# EAGLE design header (EAGLE 4.15)
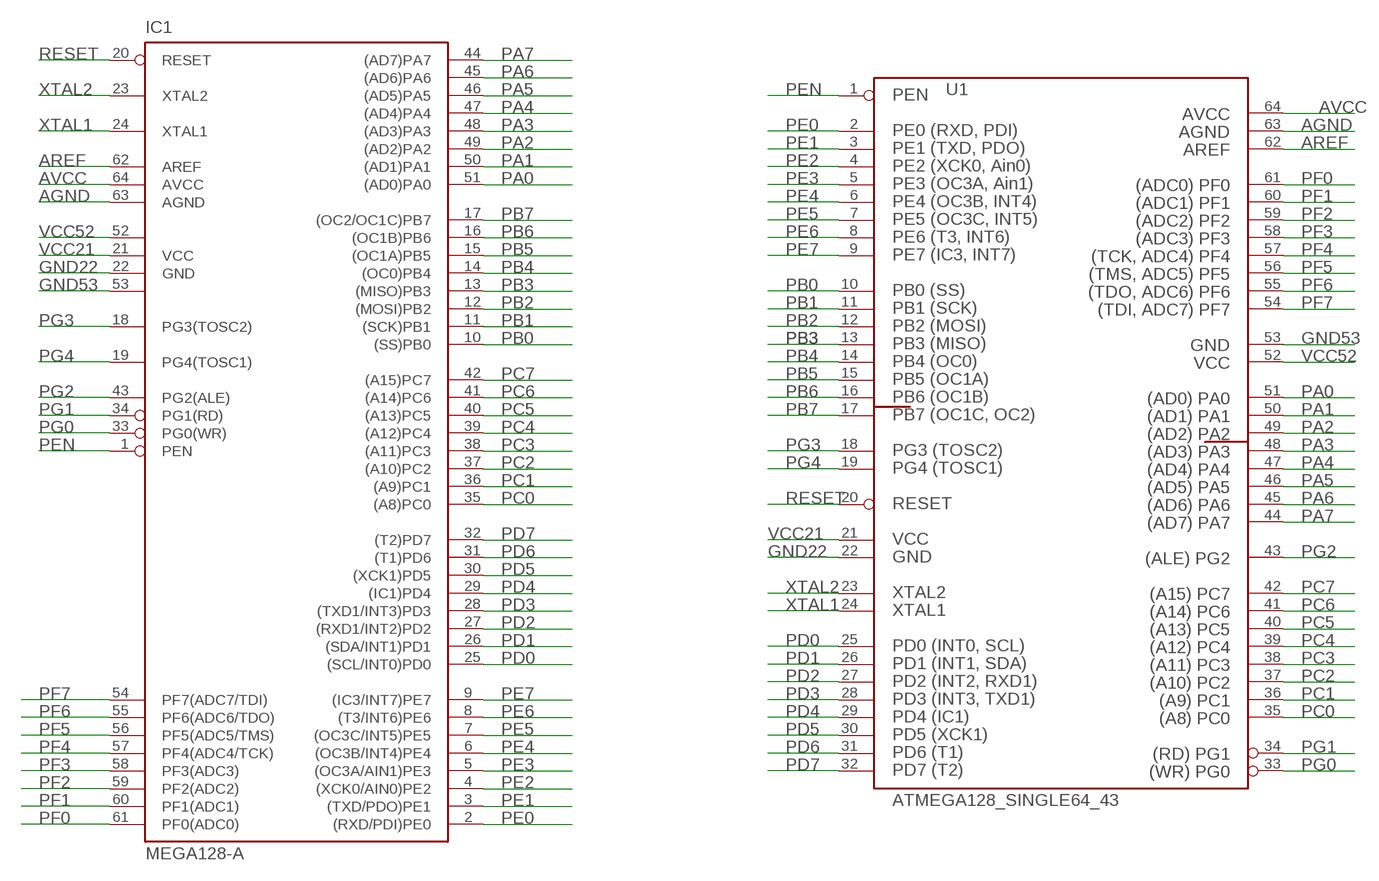
[diagram p0: schematic, sheet 1]

## Parts
IC1  MEGA128-A  [TQFP64]
U1  ATMEGA128_SINGLE64_43  [HEADER_SQR64_43]

## Nets
AGND: IC1.63(AGND) U1.63
AREF: IC1.62(AREF) U1.62
AVCC: IC1.64(AVCC) U1.64
GND22: IC1.22(GND) U1.22
GND53: IC1.53(GND1) U1.53
PA0: IC1.51((AD0)PA0) U1.51
PA1: IC1.50((AD1)PA1) U1.50
PA2: IC1.49((AD2)PA2) U1.49
PA3: IC1.48((AD3)PA3) U1.48
PA4: IC1.47((AD4)PA4) U1.47
PA5: IC1.46((AD5)PA5) U1.46
PA6: IC1.45((AD6)PA6) U1.45
PA7: IC1.44((AD7)PA7) U1.44
PB0: IC1.10((SS)PB0) U1.10
PB1: IC1.11((SCK)PB1) U1.11
PB2: IC1.12((MOSI)PB2) U1.12
PB3: IC1.13((MISO)PB3) U1.13
PB4: IC1.14((OC0)PB4) U1.14
PB5: IC1.15((OC1A)PB5) U1.15
PB6: IC1.16((OC1B)PB6) U1.16
PB7: IC1.17((OC2/OC1C)PB7) U1.17
PC0: IC1.35((A8)PC0) U1.35
PC1: IC1.36((A9)PC1) U1.36
PC2: IC1.37((A10)PC2) U1.37
PC3: IC1.38((A11)PC3) U1.38
PC4: IC1.39((A12)PC4) U1.39
PC5: IC1.40((A13)PC5) U1.40
PC6: IC1.41((A14)PC6) U1.41
PC7: IC1.42((A15)PC7) U1.42
PD0: IC1.25((SCL/INT0)PD0) U1.25
PD1: IC1.26((SDA/INT1)PD1) U1.26
PD2: IC1.27((RXD1/INT2)PD2) U1.27
PD3: IC1.28((TXD1/INT3)PD3) U1.28
PD4: IC1.29((IC1)PD4) U1.29
PD5: IC1.30((XCK1)PD5) U1.30
PD6: IC1.31((T1)PD6) U1.31
PD7: IC1.32((T2)PD7) U1.32
PE0: IC1.2((RXD/PDI)PE0) U1.2
PE1: IC1.3((TXD/PDO)PE1) U1.3
PE2: IC1.4((XCK0/AIN0)PE2) U1.4
PE3: IC1.5((OC3A/AIN1)PE3) U1.5
PE4: IC1.6((OC3B/INT4)PE4) U1.6
PE5: IC1.7((OC3C/INT5)PE5) U1.7
PE6: IC1.8((T3/INT6)PE6) U1.8
PE7: IC1.9((IC3/INT7)PE7) U1.9
PEN: IC1.1(PEN) U1.1
PF0: IC1.61(PF0(ADC0)) U1.61
PF1: IC1.60(PF1(ADC1)) U1.60
PF2: IC1.59(PF2(ADC2)) U1.59
PF3: IC1.58(PF3(ADC3)) U1.58
PF4: IC1.57(PF4(ADC4/TCK)) U1.57
PF5: IC1.56(PF5(ADC5/TMS)) U1.56
PF6: IC1.55(PF6(ADC6/TDO)) U1.55
PF7: IC1.54(PF7(ADC7/TDI)) U1.54
PG0: IC1.33(PG0(WR)) U1.33
PG1: IC1.34(PG1(RD)) U1.34
PG2: IC1.43(PG2(ALE)) U1.43
PG3: IC1.18(PG3(TOSC2)) U1.18
PG4: IC1.19(PG4(TOSC1)) U1.19
RESET: IC1.20(RESET) U1.20
VCC21: IC1.21(VCC) U1.21
VCC52: IC1.52(VCC1) U1.52
XTAL1: IC1.24(XTAL1) U1.24
XTAL2: IC1.23(XTAL2) U1.23

## Library data of the parts
IC1 = avr-4:MEGA128: MICROCONTROLLER 128 Kbytes FLASH 4 Kbytes SRAM 4 Kbytes EEPROM DUAL USART 8-channel 10 bit ADC
U1 = atmel_prototype_header:ATMEGA128: MICROCONTROLLER 128 Kbytes FLASH 4 Kbytes SRAM 4 Kbytes EEPROM DUAL USART 8-channel 10 bit ADC

## Board
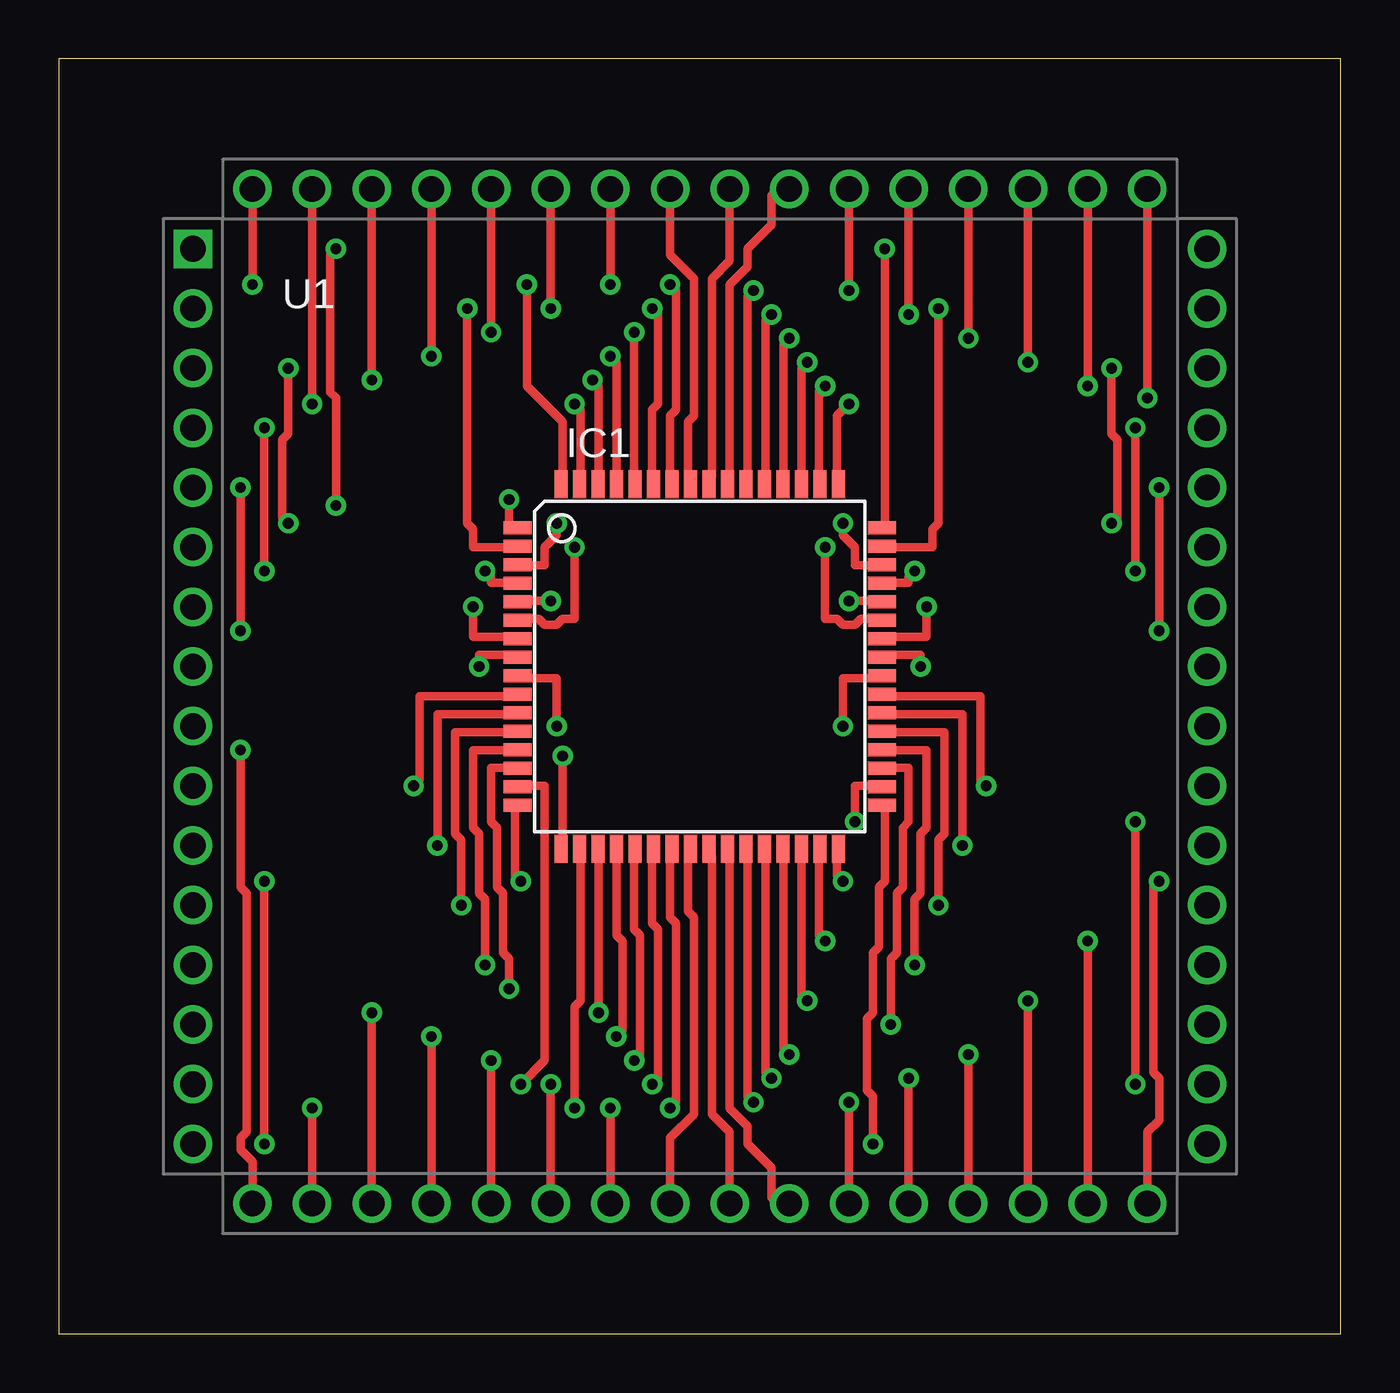
[diagram p1: board, top side]
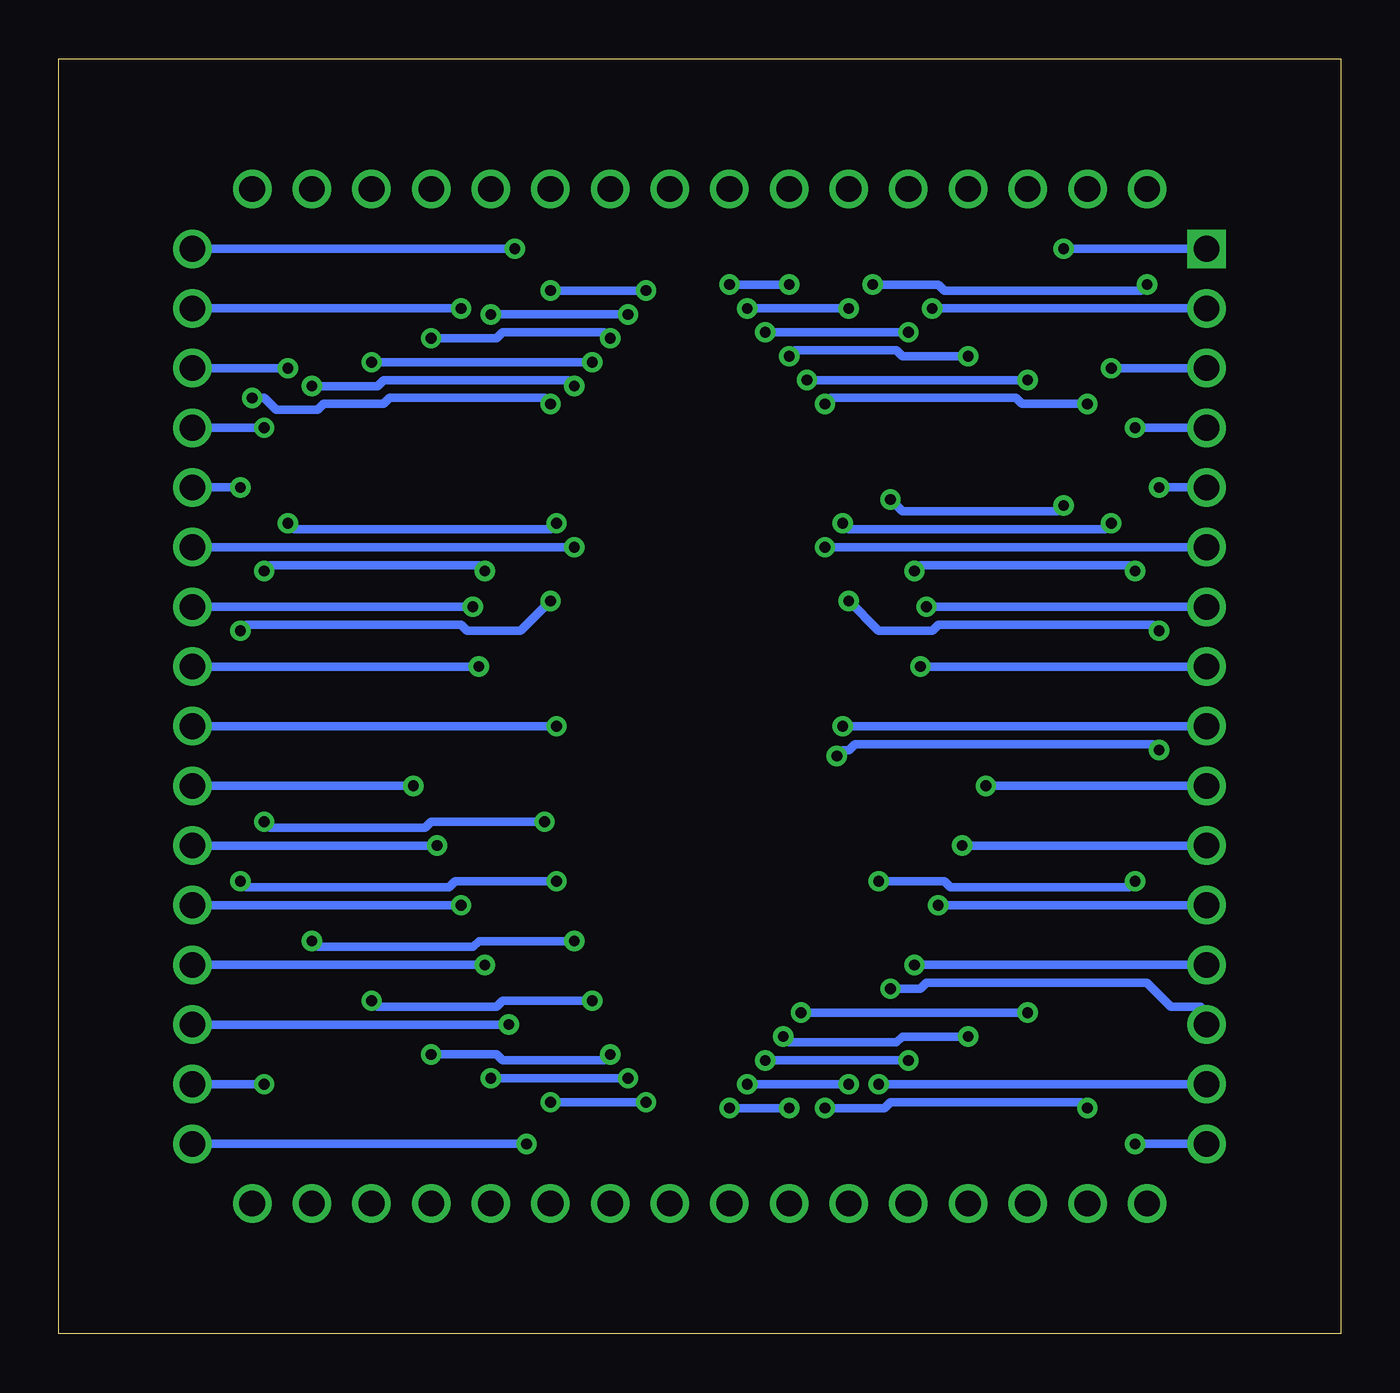
[diagram p2: board, bottom side, seen from below]

Size 54.59 x 54.28 mm. Coordinates in mm from the lower left corner, seen from the top.
Outline: 0,0 54.59,0 54.59,54.28 0,54.28 0,0
Copper layers (1*16): Top 0.035mm / dielectric 1.5mm / Bottom 0.035mm
Design rules "default": minimum track width 14mil, minimum drill 18mil, track to track 8mil, track to pad 8mil, pad to pad 10mil, via to via 10mil, smd to smd 8mil, copper to edge 20mil, drill to drill 8mil, minimum pad ring 10mil, minimum via ring 8mil, stop-mask expansion 1mil, vias tented up to drill 0mil, thermal gap 10mil

### Footprints (pad centres in the part's own frame; a part is rotated, then mirrored left to right if it is on the bottom)
TQFP64 = smd 1.194 x 0.559: 1 -7.76,5.905; 2 -7.76,5.118; 3 -7.76,4.331; 4 -7.76,3.543; 5 -7.76,2.756; 6 -7.76,1.968; 7 -7.76,1.181; 8 -7.76,0.394; 9 -7.76,-0.394; 10 -7.76,-1.181; 11 -7.76,-1.968; 12 -7.76,-2.756; 13 -7.76,-3.543; 14 -7.76,-4.331; 15 -7.76,-5.118; 16 -7.76,-5.905; 33 7.76,-5.905; 34 7.76,-5.118; 35 7.76,-4.331; 36 7.76,-3.543; 37 7.76,-2.756; 38 7.76,-1.968; 39 7.76,-1.181; 40 7.76,-0.394; 41 7.76,0.394; 42 7.76,1.181; 43 7.76,1.968; 44 7.76,2.756; 45 7.76,3.543; 46 7.76,4.331; 47 7.76,5.118; 48 7.76,5.905 | smd 0.559 x 1.194: 17 -5.905,-7.76; 18 -5.118,-7.76; 19 -4.331,-7.76; 20 -3.543,-7.76; 21 -2.756,-7.76; 22 -1.968,-7.76; 23 -1.181,-7.76; 24 -0.394,-7.76; 25 0.394,-7.76; 26 1.181,-7.76; 27 1.968,-7.76; 28 2.756,-7.76; 29 3.543,-7.76; 30 4.331,-7.76; 31 5.118,-7.76; 32 5.905,-7.76; 49 5.905,7.76; 50 5.118,7.76; 51 4.331,7.76; 52 3.543,7.76; 53 2.756,7.76; 54 1.968,7.76; 55 1.181,7.76; 56 0.394,7.76; 57 -0.394,7.76; 58 -1.181,7.76; 59 -1.968,7.76; 60 -2.756,7.76; 61 -3.543,7.76; 62 -4.331,7.76; 63 -5.118,7.76; 64 -5.905,7.76
HEADER_SQR64_43 = drill 1.092 square: 1 -21.59,19.05 | drill 1.092 round: 2 -21.59,16.51; 3 -21.59,13.97; 4 -21.59,11.43; 5 -21.59,8.89; 6 -21.59,6.35; 7 -21.59,3.81; 8 -21.59,1.27; 9 -21.59,-1.27; 10 -21.59,-3.81; 11 -21.59,-6.35; 12 -21.59,-8.89; 13 -21.59,-11.43; 14 -21.59,-13.97; 15 -21.59,-16.51; 16 -21.59,-19.05; 17 -19.05,-21.59; 18 -16.51,-21.59; 19 -13.97,-21.59; 20 -11.43,-21.59; 21 -8.89,-21.59; 22 -6.35,-21.59; 23 -3.81,-21.59; 24 -1.27,-21.59; 25 1.27,-21.59; 26 3.81,-21.59; 27 6.35,-21.59; 28 8.89,-21.59; 29 11.43,-21.59; 30 13.97,-21.59; 31 16.51,-21.59; 32 19.05,-21.59; 33 21.59,-19.05; 34 21.59,-16.51; 35 21.59,-13.97; 36 21.59,-11.43; 37 21.59,-8.89; 38 21.59,-6.35; 39 21.59,-3.81; 40 21.59,-1.27; 41 21.59,1.27; 42 21.59,3.81; 43 21.59,6.35; 44 21.59,8.89; 45 21.59,11.43; 46 21.59,13.97; 47 21.59,16.51; 48 21.59,19.05; 49 19.05,21.59; 50 16.51,21.59; 51 13.97,21.59; 52 11.43,21.59; 53 8.89,21.59; 54 6.35,21.59; 55 3.81,21.59; 56 1.27,21.59; 57 -1.27,21.59; 58 -3.81,21.59; 59 -6.35,21.59; 60 -8.89,21.59; 61 -11.43,21.59; 62 -13.97,21.59; 63 -16.51,21.59; 64 -19.05,21.59

### Placement (x,y rotation side)
IC1  27.3,28.41 0 top
U1  27.3,27.14 0 top

### Tracks (layer width: path | path; a pad name or v marks a point on that pad's centre or on a via)
AGND  (via drill 0.46)
  Top 0.356: v21.97,39.59 22.22,39.33 22.22,36.54 IC1.63 | v10.79,39.59 U1.63
  Bottom 0.356: v21.97,39.59 21.71,39.84 13.84,39.84 13.58,39.59 v10.79,39.59
AREF  (via drill 0.46)
  Top 0.356: v22.73,40.6 22.98,40.35 22.98,36.54 IC1.62 | v13.33,40.6 U1.62
  Bottom 0.356: v13.33,40.6 v22.73,40.6
AVCC  (via drill 0.46)
  Top 0.356: v19.93,44.67 19.93,40.35 21.46,38.82 21.46,36.54 IC1.64 | v8.25,44.67 U1.64
  Bottom 0.356: v19.93,44.67 17.14,44.67 16.89,44.41 8.5,44.41 v8.25,44.67
GND22  (via drill 0.46)
  Top 0.356: v25.27,10.63 25.52,10.88 25.52,17.23 25.27,17.49 25.27,20.28 IC1.22 | U1.22 v20.95,10.63
  Bottom 0.356: v20.95,10.63 v25.27,10.63
GND53  (via drill 0.46)
  Top 0.356: v30.35,43.4 30.09,43.14 30.09,36.54 IC1.53 | v36.19,43.4 U1.53
  Bottom 0.356: v30.35,43.4 v36.19,43.4
PA0  (via drill 0.46)
  Top 0.356: v31.87,41.36 31.62,41.11 31.62,36.54 IC1.51 | v41.27,41.36 U1.51
  Bottom 0.356: v31.87,41.36 v41.27,41.36
PA1  (via drill 0.46)
  Top 0.356: v32.63,40.35 32.38,40.09 32.38,36.54 IC1.50 | v43.81,40.35 U1.50
  Bottom 0.356: v32.63,40.35 32.89,40.6 40.76,40.6 41.02,40.35 v43.81,40.35
PA2  (via drill 0.46)
  Top 0.356: v33.65,39.59 33.14,39.08 33.14,36.54 IC1.49 | v46.35,39.84 U1.49
  Bottom 0.356: v33.65,39.59 33.9,39.84 40.51,39.84 40.76,39.59 43.3,39.59 43.56,39.33 45.33,39.33 45.84,39.84 v46.35,39.84
PA3  (via drill 0.46)
  Top 0.356: v35.17,46.19 35.17,34.51 IC1.48
  Bottom 0.356: v35.17,46.19 U1.48
PA4  (via drill 0.46)
  Top 0.356: v37.46,43.65 37.46,34.51 37.21,34.25 37.21,33.49 35.43,33.49 IC1.47
  Bottom 0.356: v37.46,43.65 U1.47
PA5  (via drill 0.46)
  Top 0.356: v33.4,34.51 33.4,34 33.9,33.49 33.9,32.73 34.67,32.73 IC1.46 | v44.83,34.51 45.08,34.76 45.08,38.06 44.83,38.32 v44.83,41.11
  Bottom 0.356: v33.4,34.51 33.65,34.25 44.57,34.25 v44.83,34.51 | v44.83,41.11 U1.46
PA6  (via drill 0.46)
  Top 0.356: v36.44,32.47 36.19,32.22 36.19,31.97 35.43,31.97 IC1.45 | v45.84,32.47 v45.84,38.57
  Bottom 0.356: v36.44,32.47 36.7,32.73 45.59,32.73 v45.84,32.47 | v45.84,38.57 U1.45
PA7  (via drill 0.46)
  Top 0.356: v33.65,31.2 34.67,31.2 IC1.44 | v46.86,29.93 v46.86,36.03
  Bottom 0.356: v33.65,31.2 34.92,29.93 37.21,29.93 37.46,30.19 46.6,30.19 v46.86,29.93 | v46.86,36.03 U1.44
PB0  (via drill 0.46)
  Top 0.356: v15.11,23.33 15.36,23.58 15.36,27.14 19.17,27.14 IC1.10
  Bottom 0.356: U1.10 v15.11,23.33
PB1  (via drill 0.46)
  Top 0.356: v16.12,20.79 16.12,26.38 19.17,26.38 IC1.11
  Bottom 0.356: U1.11 v16.12,20.79
PB2  (via drill 0.46)
  Top 0.356: v17.14,18.25 17.14,21.04 16.89,21.3 16.89,25.62 19.17,25.62 IC1.12
  Bottom 0.356: U1.12 v17.14,18.25
PB3  (via drill 0.46)
  Top 0.356: v18.16,15.71 18.16,18.5 17.9,18.76 17.9,21.3 17.65,21.55 17.65,24.85 19.17,24.85 IC1.13
  Bottom 0.356: U1.13 v18.16,15.71
PB4  (via drill 0.46)
  Top 0.356: v19.17,14.69 19.17,15.96 18.92,16.22 18.92,18.76 18.66,19.01 18.66,21.55 18.41,21.81 18.41,24.09 19.17,24.09 IC1.14
  Bottom 0.356: v19.17,14.69 17.9,14.69 17.65,14.95 8.25,14.95 7.23,13.93 5.96,13.93 U1.14
PB5  (via drill 0.46)
  Top 0.356: v19.68,10.63 20.7,11.65 20.7,23.33 19.93,23.33 IC1.15
  Bottom 0.356: U1.15 v19.68,10.63
PB6  (via drill 0.46)
  Top 0.356: v19.68,19.27 19.43,19.52 19.43,22.31 IC1.16 | v8.76,8.09 v8.76,19.27
  Bottom 0.356: v19.68,19.27 16.89,19.27 16.63,19.01 9.01,19.01 v8.76,19.27 | U1.16 v8.76,8.09
PB7  (via drill 0.46)
  Top 0.356: v21.46,24.6 21.46,21.04 IC1.17 | v7.74,24.85 7.74,19.01 8,18.76 8,8.6 7.74,8.34 7.74,7.84 8.25,7.33 U1.17
  Bottom 0.356: v21.46,24.6 21.2,24.85 20.95,24.85 20.7,25.11 8,25.11 v7.74,24.85
PC0  (via drill 0.46)
  Top 0.356: v35.43,13.17 35.43,15.96 35.68,16.22 35.68,18.76 35.94,19.01 35.94,21.55 36.19,21.81 36.19,24.09 35.43,24.09 IC1.35
  Bottom 0.356: v35.43,13.17 U1.35
PC1  (via drill 0.46)
  Top 0.356: v36.44,15.71 36.44,18.5 36.7,18.76 36.7,21.3 36.95,21.55 36.95,24.85 35.43,24.85 IC1.36
  Bottom 0.356: v36.44,15.71 U1.36
PC2  (via drill 0.46)
  Top 0.356: v37.46,18.25 37.46,21.04 37.71,21.3 37.71,25.62 35.43,25.62 IC1.37
  Bottom 0.356: v37.46,18.25 U1.37
PC3  (via drill 0.46)
  Top 0.356: v38.48,20.79 38.48,26.38 35.43,26.38 IC1.38
  Bottom 0.356: v38.48,20.79 U1.38
PC4  (via drill 0.46)
  Top 0.356: v39.49,23.33 39.24,23.58 39.24,27.14 35.43,27.14 IC1.39
  Bottom 0.356: v39.49,23.33 U1.39
PC5  (via drill 0.46)
  Top 0.356: v33.4,25.87 33.4,27.9 34.67,27.9 IC1.40
  Bottom 0.356: v33.4,25.87 U1.40
PC6  (via drill 0.46)
  Top 0.356: v36.7,28.41 36.7,28.92 35.43,28.92 IC1.41
  Bottom 0.356: v36.7,28.41 U1.41
PC7  (via drill 0.46)
  Top 0.356: v36.95,30.95 36.95,29.68 35.43,29.68 IC1.42
  Bottom 0.356: v36.95,30.95 U1.42
PD0
  Top 0.356: IC1.25 27.81,20.28 27.81,9.36 28.57,8.6 U1.25
PD1
  Top 0.356: IC1.26 28.57,20.28 28.57,9.61 29.33,8.85 29.33,8.09 30.35,7.07 30.35,5.8 U1.26
PD2  (via drill 0.46)
  Top 0.356: v29.59,9.87 29.33,10.12 29.33,20.28 IC1.27 | v33.65,9.87 U1.27
  Bottom 0.356: v29.59,9.87 v33.65,9.87
PD3  (via drill 0.46)
  Top 0.356: v30.35,10.88 30.09,11.14 30.09,20.28 IC1.28 | U1.28 v36.19,10.88
  Bottom 0.356: v36.19,10.88 v30.35,10.88
PD4  (via drill 0.46)
  Top 0.356: v31.11,11.9 30.86,12.15 30.86,20.28 IC1.29 | v38.73,11.9 U1.29
  Bottom 0.356: v31.11,11.9 31.36,11.65 35.68,11.65 35.94,11.9 v38.73,11.9
PD5  (via drill 0.46)
  Top 0.356: v31.87,14.19 31.62,14.44 31.62,20.28 IC1.30 | v41.27,14.19 U1.30
  Bottom 0.356: v31.87,14.19 35.68,14.19 35.94,13.93 41.02,13.93 v41.27,14.19
PD6  (via drill 0.46)
  Top 0.356: v32.63,16.73 32.38,16.98 32.38,20.28 IC1.31 | U1.31 v43.81,16.73
  Bottom 0.356: v32.63,16.73 36.7,16.73 36.95,16.47 43.56,16.47 v43.81,16.73
PD7  (via drill 0.46)
  Top 0.356: v33.4,19.27 33.14,19.52 33.14,20.28 IC1.32 | v46.86,19.27 46.6,19.01 46.6,11.14 46.86,10.88 46.86,9.11 46.35,8.6 U1.32
  Bottom 0.356: v33.4,19.27 37.71,19.27 37.97,19.01 46.6,19.01 v46.86,19.27
PE0  (via drill 0.46)
  Top 0.356: v17.39,43.65 17.39,34.51 17.65,34.25 17.65,33.49 19.17,33.49 IC1.2
  Bottom 0.356: U1.2 v17.39,43.65
PE1  (via drill 0.46)
  Top 0.356: v21.2,34.51 21.2,34 20.7,33.49 20.7,32.73 19.93,32.73 IC1.3 | v9.77,34.51 9.52,34.76 9.52,38.06 9.77,38.32 v9.77,41.11
  Bottom 0.356: v21.2,34.51 20.95,34.25 10.03,34.25 v9.77,34.51 | v9.77,41.11 U1.3
PE2  (via drill 0.46)
  Top 0.356: v18.16,32.47 18.41,32.22 18.41,31.97 19.17,31.97 IC1.4 | v8.76,32.47 v8.76,38.57
  Bottom 0.356: v18.16,32.47 17.9,32.73 9.01,32.73 v8.76,32.47 | v8.76,38.57 U1.4
PE3  (via drill 0.46)
  Top 0.356: v20.95,31.2 19.93,31.2 IC1.5 | v7.74,29.93 v7.74,36.03
  Bottom 0.356: v20.95,31.2 19.68,29.93 17.39,29.93 17.14,30.19 8,30.19 v7.74,29.93 | v7.74,36.03 U1.5
PE4  (via drill 0.46)
  Top 0.356: v21.97,33.49 21.97,30.44 21.46,30.44 21.2,30.19 20.7,30.19 20.44,30.44 19.93,30.44 IC1.6
  Bottom 0.356: U1.6 v21.97,33.49
PE5  (via drill 0.46)
  Top 0.356: v17.65,30.95 17.65,29.68 19.17,29.68 IC1.7
  Bottom 0.356: U1.7 v17.65,30.95
PE6  (via drill 0.46)
  Top 0.356: v17.9,28.41 17.9,28.92 19.17,28.92 IC1.8
  Bottom 0.356: U1.8 v17.9,28.41
PE7  (via drill 0.46)
  Top 0.356: v21.2,25.87 21.2,27.9 19.93,27.9 IC1.9
  Bottom 0.356: U1.9 v21.2,25.87
PEN  (via drill 0.46)
  Top 0.356: v19.17,35.52 19.17,34.51 IC1.1 | v11.81,35.27 11.81,39.84 11.55,40.09 11.55,45.94 v11.81,46.19
  Bottom 0.356: v19.17,35.52 18.66,35.01 12.06,35.01 v11.81,35.27 | v11.81,46.19 U1.1
PF0  (via drill 0.46)
  Top 0.356: v23.49,41.62 23.74,41.36 23.74,36.54 IC1.61 | v15.87,41.62 U1.61
  Bottom 0.356: v23.49,41.62 23.24,41.87 18.92,41.87 18.66,41.62 v15.87,41.62
PF1  (via drill 0.46)
  Top 0.356: v24.51,42.63 24.51,36.54 IC1.60 | v18.41,42.63 U1.60
  Bottom 0.356: v24.51,42.63 v18.41,42.63
PF2  (via drill 0.46)
  Top 0.356: v25.27,43.65 25.52,43.4 25.52,39.59 25.27,39.33 25.27,36.54 IC1.59 | v20.95,43.65 U1.59
  Bottom 0.356: v25.27,43.65 v20.95,43.65
PF3  (via drill 0.46)
  Top 0.356: v26.03,44.67 26.28,44.41 26.28,39.33 26.03,39.08 26.03,36.54 IC1.58 | v23.49,44.67 U1.58
  Bottom 0.356: v26.03,44.67 v23.49,44.67
PF4
  Top 0.356: IC1.57 26.79,36.54 26.79,38.82 27.05,39.08 27.05,44.92 26.03,45.94 U1.57
PF5
  Top 0.356: IC1.56 27.81,36.54 27.81,44.92 28.57,45.68 U1.56
PF6
  Top 0.356: IC1.55 28.57,36.54 28.57,44.67 29.33,45.43 29.33,46.19 30.35,47.21 30.35,48.48 U1.55
PF7  (via drill 0.46)
  Top 0.356: v29.59,44.41 29.33,44.16 29.33,36.54 IC1.54 | v33.65,44.41 U1.54
  Bottom 0.356: v29.59,44.41 v33.65,44.41
PG0  (via drill 0.46)
  Top 0.356: v34.67,8.09 34.67,10.12 34.41,10.38 34.41,13.42 34.67,13.68 34.67,16.22 34.92,16.47 34.92,19.01 35.17,19.27 35.17,22.31 IC1.33
  Bottom 0.356: v34.67,8.09 U1.33
PG1  (via drill 0.46)
  Top 0.356: v33.9,21.81 33.9,23.33 34.67,23.33 IC1.34 | v45.84,21.81 v45.84,10.63
  Bottom 0.356: v33.9,21.81 38.73,21.81 38.98,21.55 45.59,21.55 v45.84,21.81 | v45.84,10.63 U1.34
PG2  (via drill 0.46)
  Top 0.356: v32.63,33.49 32.63,30.44 33.14,30.44 33.4,30.19 33.9,30.19 34.16,30.44 34.67,30.44 IC1.43
  Bottom 0.356: v32.63,33.49 U1.43
PG3  (via drill 0.46)
  Top 0.356: v21.97,9.61 21.97,13.93 22.22,14.19 22.22,20.28 IC1.18 | U1.18 v10.79,9.61
  Bottom 0.356: v21.97,9.61 19.43,9.61 19.17,9.87 11.04,9.87 v10.79,9.61
PG4  (via drill 0.46)
  Top 0.356: v22.98,13.68 22.98,20.28 IC1.19 | U1.19 v13.33,13.68
  Bottom 0.356: v13.33,13.68 v22.98,13.68
RESET  (via drill 0.46)
  Top 0.356: v23.74,12.66 24,12.92 24,16.73 23.74,16.98 23.74,20.28 IC1.20 | U1.20 v15.87,12.66
  Bottom 0.356: v23.74,12.66 23.49,12.41 18.92,12.41 18.66,12.66 v15.87,12.66
VCC21  (via drill 0.46)
  Top 0.356: v24.51,11.65 24.76,11.9 24.76,16.98 24.51,17.23 24.51,20.28 IC1.21 | U1.21 v18.41,11.65
  Bottom 0.356: v18.41,11.65 v24.51,11.65
VCC52  (via drill 0.46)
  Top 0.356: v31.11,42.38 30.86,42.13 30.86,36.54 IC1.52 | v38.73,42.38 U1.52
  Bottom 0.356: v31.11,42.38 31.36,42.63 35.68,42.63 35.94,42.38 v38.73,42.38
XTAL1
  Top 0.356: IC1.24 26.79,20.28 26.79,18 27.05,17.74 27.05,9.36 26.03,8.34 U1.24
XTAL2  (via drill 0.46)
  Top 0.356: v26.03,9.61 26.28,9.87 26.28,17.49 26.03,17.74 26.03,20.28 IC1.23 | U1.23 v23.49,9.61
  Bottom 0.356: v23.49,9.61 v26.03,9.61